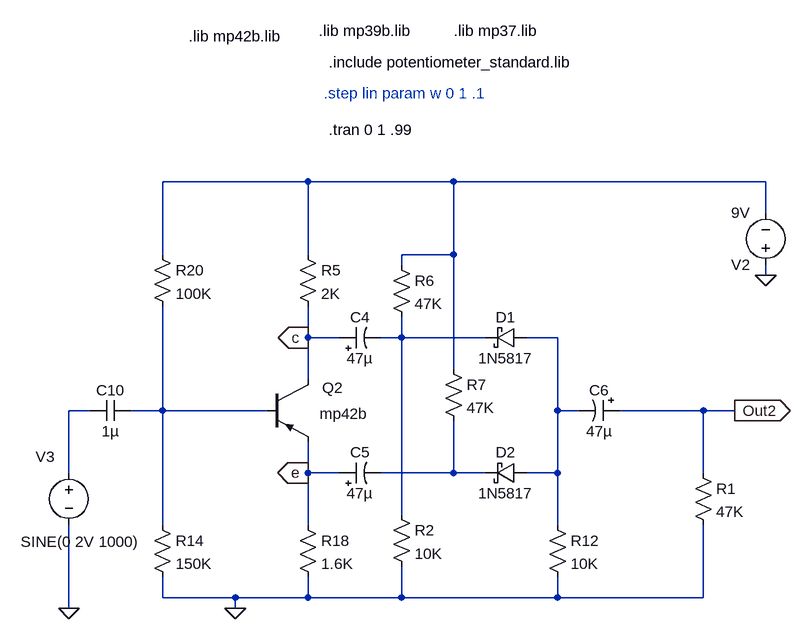
[diagram p0: schematic octaver.asc]
octaver.asc, the LTspice schematic file:
Version 4
SHEET 1 984 1092
WIRE -896 0 -1120 0
WIRE -672 0 -896 0
WIRE -192 0 -672 0
WIRE -192 48 -192 0
WIRE -1120 112 -1120 0
WIRE -896 112 -896 0
WIRE -672 112 -672 0
WIRE -672 112 -752 112
WIRE -752 128 -752 112
WIRE -192 144 -192 128
WIRE -896 240 -896 192
WIRE -848 240 -896 240
WIRE -752 240 -752 208
WIRE -752 240 -784 240
WIRE -624 240 -752 240
WIRE -512 240 -560 240
WIRE -672 288 -672 112
WIRE -896 304 -896 240
WIRE -1232 352 -1264 352
WIRE -1120 352 -1120 192
WIRE -1120 352 -1168 352
WIRE -960 352 -1120 352
WIRE -512 352 -512 240
WIRE -480 352 -512 352
WIRE -288 352 -416 352
WIRE -240 352 -288 352
WIRE -1264 448 -1264 352
WIRE -896 448 -896 400
WIRE -848 448 -896 448
WIRE -672 448 -672 368
WIRE -672 448 -784 448
WIRE -624 448 -672 448
WIRE -512 448 -512 352
WIRE -512 448 -560 448
WIRE -288 448 -288 352
WIRE -752 512 -752 240
WIRE -1120 528 -1120 352
WIRE -896 528 -896 448
WIRE -512 528 -512 448
WIRE -1120 640 -1120 608
WIRE -1008 640 -1120 640
WIRE -896 640 -896 608
WIRE -896 640 -1008 640
WIRE -752 640 -752 592
WIRE -752 640 -896 640
WIRE -512 640 -512 608
WIRE -512 640 -752 640
WIRE -288 640 -288 528
WIRE -288 640 -512 640
WIRE -1264 656 -1264 528
WIRE -1008 656 -1008 640
FLAG -192 144 0
FLAG -240 352 Out2
IOPIN -240 352 Out
FLAG -1264 656 0
FLAG -1008 656 0
FLAG -896 240 c
IOPIN -896 240 Out
FLAG -896 448 e
IOPIN -896 448 Out
SYMBOL voltage -192 144 R180
WINDOW 123 0 0 Left 2
WINDOW 39 24 -12 Left 2
SYMATTR InstName V2
SYMATTR Value 9V
SYMBOL voltage -1264 432 R0
WINDOW 39 -112 95 Left 2
WINDOW 3 -74 122 Left 2
WINDOW 0 -51 -9 Left 2
SYMATTR Value SINE(0 2V 1000)
SYMATTR InstName V3
SYMATTR Value2 AC 1
SYMBOL pnp -960 304 R0
WINDOW 0 86 13 Left 2
WINDOW 3 82 53 Left 2
SYMATTR InstName Q2
SYMATTR Value mp42b
SYMBOL res -1136 512 R0
SYMATTR InstName R14
SYMATTR Value 150K
SYMBOL res -912 512 R0
SYMATTR InstName R18
SYMATTR Value 1.6K
SYMBOL res -1136 96 R0
SYMATTR InstName R20
SYMATTR Value 100K
SYMBOL cap -1168 336 R90
WINDOW 0 0 32 VBottom 2
WINDOW 3 32 32 VTop 2
SYMATTR InstName C10
SYMATTR Value 1µ
SYMBOL res -912 96 R0
SYMATTR InstName R5
SYMATTR Value 2K
SYMBOL polcap -848 256 R270
WINDOW 0 32 32 VTop 2
WINDOW 3 0 32 VBottom 2
SYMATTR InstName C4
SYMATTR Value 47µ
SYMBOL polcap -848 464 R270
WINDOW 0 32 32 VTop 2
WINDOW 3 0 32 VBottom 2
SYMATTR InstName C5
SYMATTR Value 47µ
SYMBOL schottky -560 224 R90
WINDOW 0 0 32 VBottom 2
WINDOW 3 32 32 VTop 2
SYMATTR InstName D1
SYMATTR Value 1N5817
SYMATTR Description Diode
SYMATTR Type diode
SYMBOL schottky -560 432 R90
WINDOW 0 0 32 VBottom 2
WINDOW 3 32 32 VTop 2
SYMATTR InstName D2
SYMATTR Value 1N5817
SYMATTR Description Diode
SYMATTR Type diode
SYMBOL res -768 112 R0
SYMATTR InstName R6
SYMATTR Value 47K
SYMBOL res -688 272 R0
SYMATTR InstName R7
SYMATTR Value 47K
SYMBOL res -528 512 R0
SYMATTR InstName R12
SYMATTR Value 10K
SYMBOL polcap -416 336 R90
WINDOW 0 0 32 VBottom 2
WINDOW 3 32 32 VTop 2
SYMATTR InstName C6
SYMATTR Value 47µ
SYMBOL res -304 432 R0
SYMATTR InstName R1
SYMATTR Value 47K
SYMBOL res -768 496 R0
SYMATTR InstName R2
SYMATTR Value 10K
TEXT -880 -232 Left 2 !.lib mp39b.lib
TEXT -672 -232 Left 2 !.lib mp37.lib
TEXT -864 -184 Left 2 !.include potentiometer_standard.lib
TEXT -872 -136 Left 2 ;.step lin param w 0 1 .1
TEXT -864 -80 Left 2 !.tran 0 1 .99
TEXT -1080 -224 Left 2 !.lib mp42b.lib

The netlist it stands for:
* octaver.asc
V2 0 N001 9V
V3 N004 0 SINE(0 2V 1000) AC 1
Q2 c N005 e 0 mp42b
R14 N005 0 150K
R18 e 0 1.6K
R20 N001 N005 100K
C10 N005 N004 1µ
R5 N001 c 2K
C4 c N002 47µ
C5 e N006 47µ
D1 N003 N002 1N5817
D2 N003 N006 1N5817
R6 N001 N002 47K
R7 N001 N006 47K
R12 N003 0 10K
C6 Out2 N003 47µ
R1 Out2 0 47K
R2 N002 0 10K
.model D D
.lib standard.dio
.model NPN NPN
.model PNP PNP
.lib standard.bjt
.lib mp39b.lib
.lib mp37.lib
.include potentiometer_standard.lib
* .step lin param w 0 1 .1
.tran 0 1 .99
.lib mp42b.lib
.backanno
.end